# EAGLE design FET_driver (EAGLE 6.5.0)
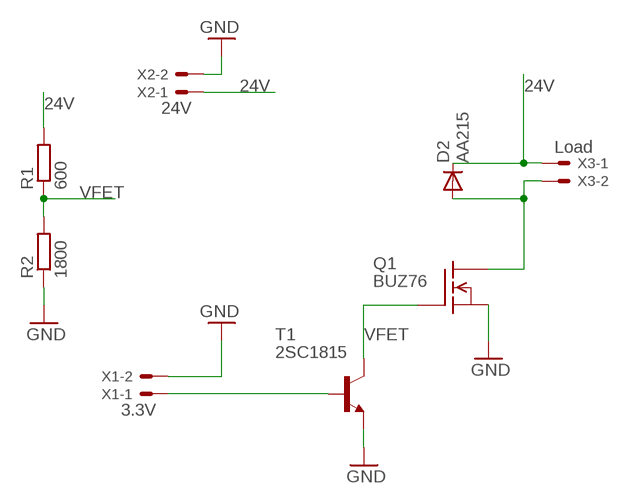
[diagram p0: schematic, sheet 1]

## Parts
D2  AA215  [DO07]
Q1  BUZ76  BUZ72  [TO220]
R1  600  R-EU_0207/10  [0207/10]
R2  1800  R-EU_0207/10  [0207/10]
T1  2SC1815  [TO92-ECB]
X1  3.3V  22-23-2021  [22-23-2021]
X2  24V  22-23-2021  [22-23-2021]
X3  Load  22-23-2021  [22-23-2021]

## Nets
24V: D2.C R1.2 X2.1 X3.1
GND: Q1.3(S) R2.1 T1.E X1.2 X2.2
N$1: D2.A Q1.2(D) X3.2
N$6: T1.B X1.1
VFET: Q1.1(G) R1.1 R2.2 T1.C

## Library data of the parts
D2 = diode:AA215: DIODE germanium
Q1 = transistor-fet:BUZ72: N-Channel Enhancement MOSFET 100V; 10A; 0,2Ohm
R1 R2 = resistor:R-EU_: RESISTOR, European symbol
T1 = transistor:2SC1815: NPN EPITAXIAL TRANSISTOR Source: TOSHIBA .. 2SC1815 1.pdf
X1-X3 = con-molex:22-23-2021: .100" (2.54mm) Center Header - 2 Pin; MF: MOLEX; MPN: 22-23-2021; OC_FARNELL: 1462926; OC_NEWARK: 25C3832

## Board
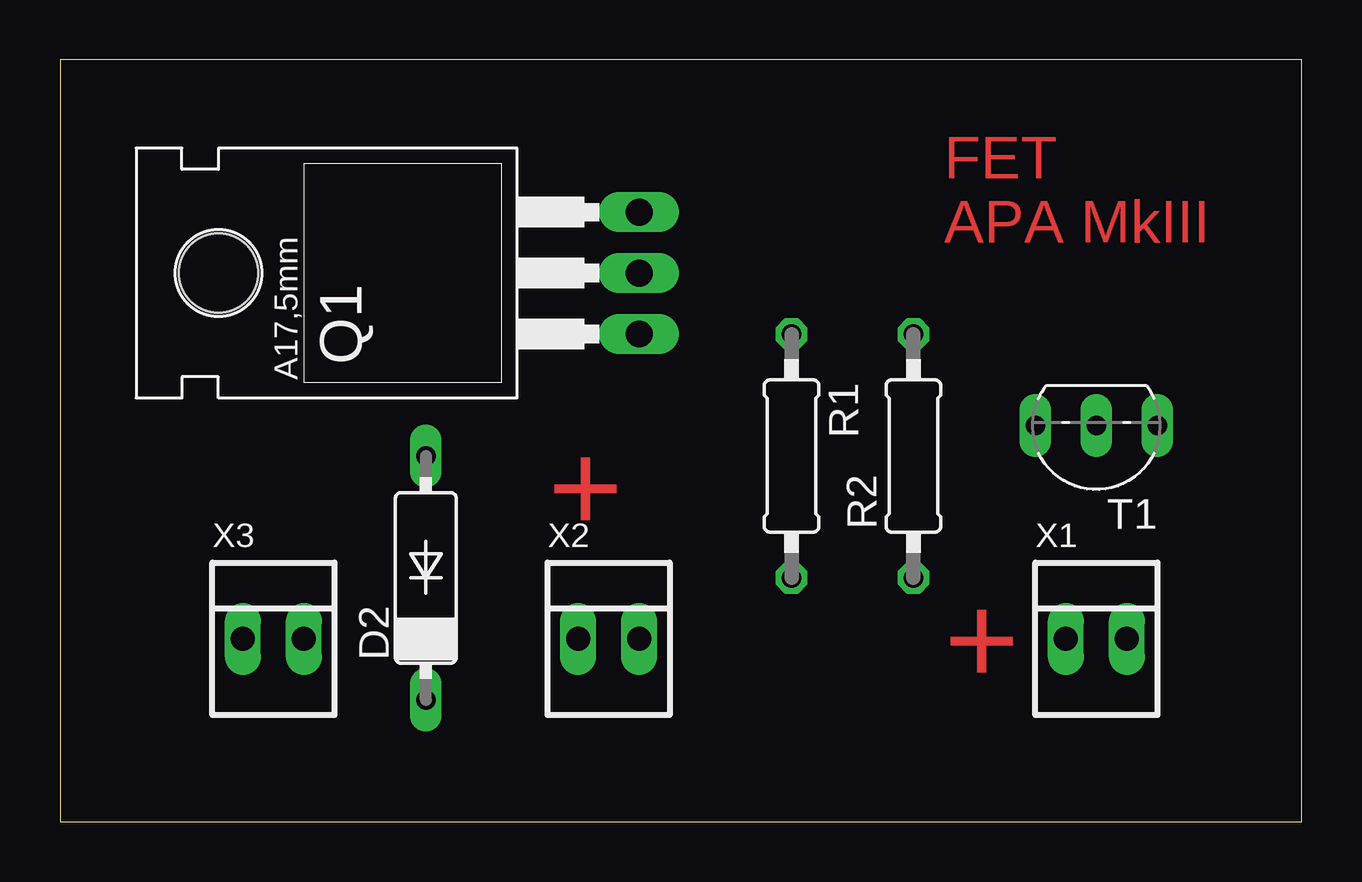
[diagram p1: board, top side]
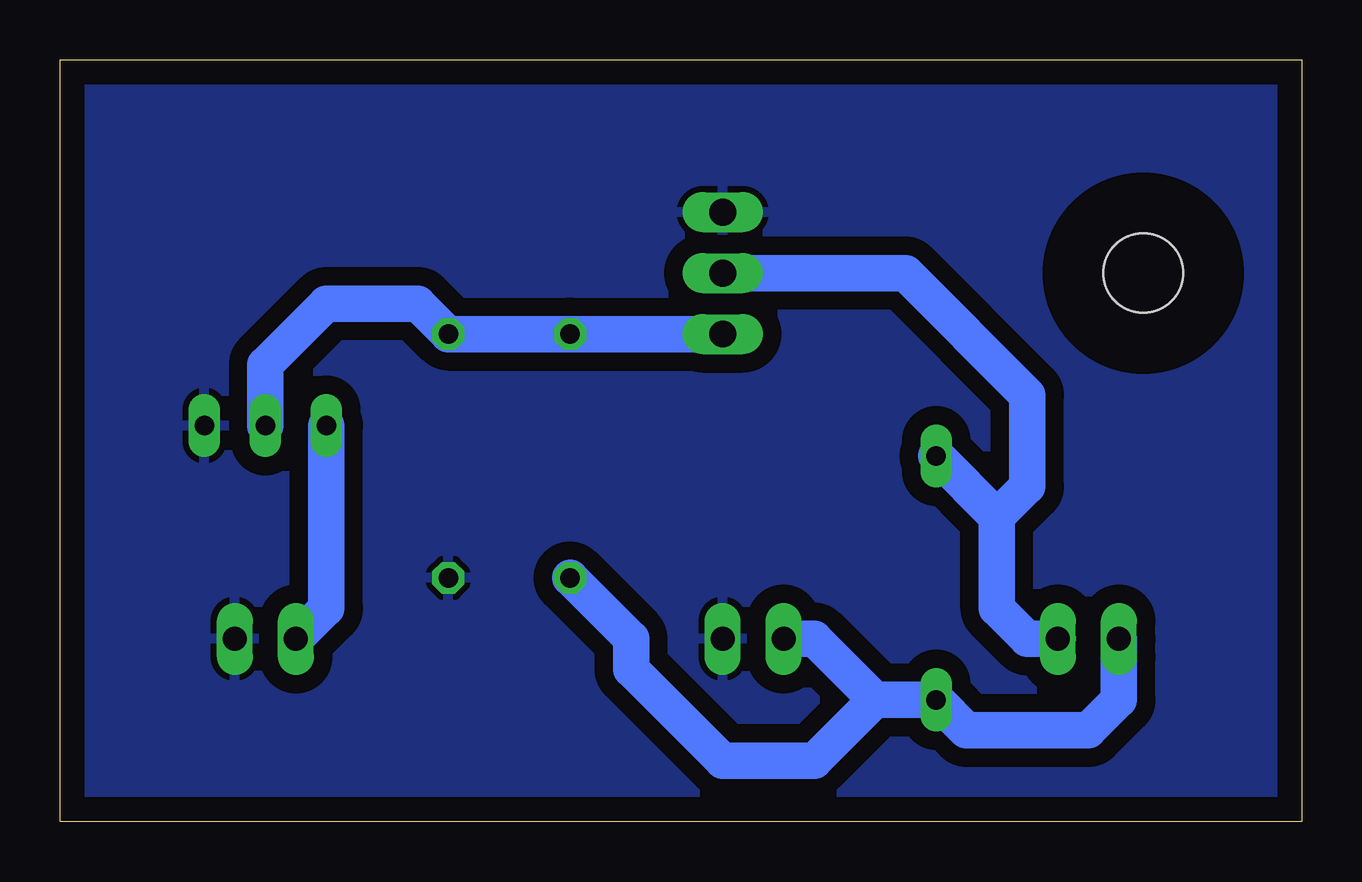
[diagram p2: board, bottom side, seen from below]

Size 51.74 x 31.74 mm. Coordinates in mm from the lower left corner, seen from the top.
Outline: 0,0 51.74,0 51.74,31.74 0,31.74 0,0
Copper layers (1*16): Top 0.035mm / dielectric 1.5mm / Bottom 0.035mm
Design rules "default *": minimum track width 60mil, minimum drill 24mil, track to track 30mil, track to pad 30mil, pad to pad 8mil, via to via 8mil, smd to smd 8mil, copper to edge 40mil, drill to drill 8mil, minimum pad ring 10mil, minimum via ring 8mil, stop-mask expansion 4mil, vias tented up to drill 0mil, thermal gap 10mil

### Footprints (pad centres in the part's own frame; a part is rotated, then mirrored left to right if it is on the bottom)
DO07 = drill 0.813 long: A 5.08,0; C -5.08,0
TO220 = drill 1.118 long: 1 -2.54,-6.35; 2 0,-6.35; 3 2.54,-6.35 | hole 3.302: 0,11.176
0207/10 = drill 0.813 octagon: 1 -5.08,0; 2 5.08,0
TO92-ECB = drill 0.813 long: B 2.54,0; C 0,0; E -2.54,0
22-23-2021 = drill 1 long: 1 -1.27,0; 2 1.27,0

### Placement (x,y rotation side)
D2  15.24,10.16 90 top
Q1  17.78,22.86 90 top
R1  30.48,15.24 270 top
R2  35.56,15.24 90 top
T1  43.18,16.51 180 top
X1  43.18,7.62 0 top
X2  22.86,7.62 0 top
X3  8.89,7.62 0 top

### Tracks (layer width: path | path; a pad name or v marks a point on that pad's centre or on a via)
24V
  Bottom 1.524: 17.78,5.08 D2.C 13.97,3.81 8.89,3.81 7.62,5.08 X3.1 | 17.78,5.08 20.32,7.62 X2.1 | R1.2 27.94,7.62 27.94,6.35 24.13,2.54 20.32,2.54 17.78,5.08
GND
  pour Bottom: 0,0 52.07,0 52.07,31.75 0,31.75
N$1
  Bottom 1.524: 12.7,12.7 D2.A | 12.7,12.7 12.7,8.89 11.43,7.62 X3.2 | Q1.2 16.51,22.86 11.43,17.78 11.43,13.97 12.7,12.7
N$6
  Bottom 1.524: T1.B 40.64,8.89 X1.1
VFET
  Bottom 1.524: T1.C 43.18,19.05 40.64,21.59 36.83,21.59 R2.2 R1.1 Q1.1

### Text on the board
Top: FET / APA MkIII | + | +